# Altium schematic sheet DualRail_TPS6513x.SchDoc
size A4
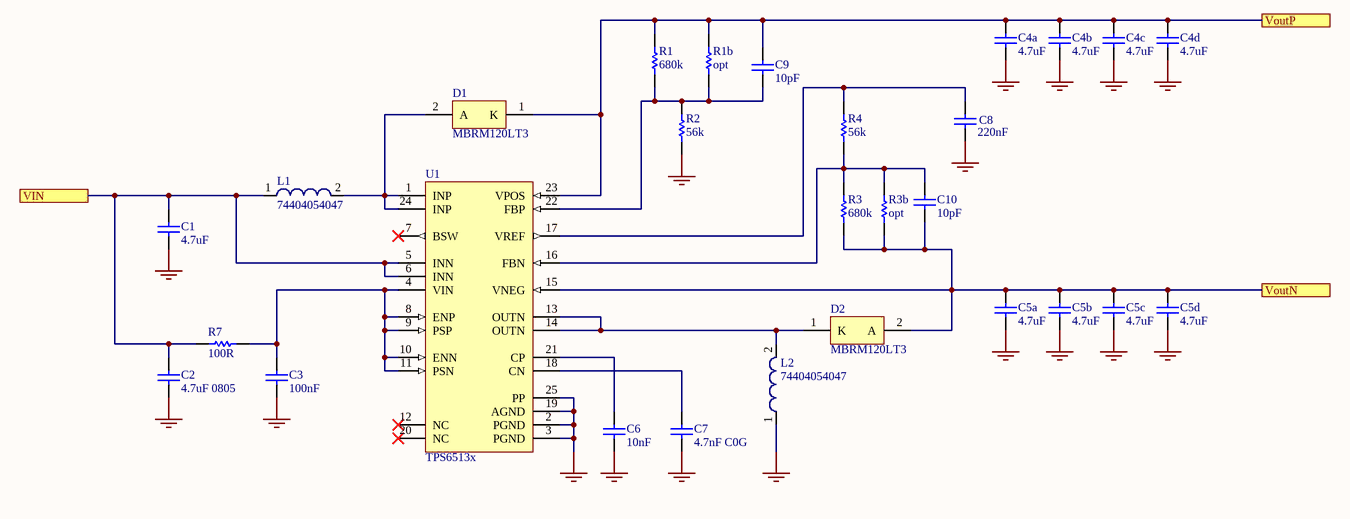
[diagram p0: DualRail_TPS6513x.SchDoc]

## Parts
C1  4.7uF  [CAPC1206(3216)190_L]
C2  4.7uF 0805  [CAPC0805(2012)155_N]
C3  100nF  [CAPC0603(1608)100_L]
C4a  4.7uF  [CAPC1206(3216)190_L]
C4b  4.7uF  [CAPC1206(3216)190_L]
C4c  4.7uF  [CAPC1206(3216)190_L]
C4d  4.7uF  [CAPC1206(3216)190_L]
C5a  4.7uF  [CAPC1206(3216)190_L]
C5b  4.7uF  [CAPC1206(3216)190_L]
C5c  4.7uF  [CAPC1206(3216)190_L]
C5d  4.7uF  [CAPC1206(3216)190_L]
C6  10nF  [CAPC0603(1608)100_L]
C7  4.7nF C0G  [CAPC0805(2012)75_L]
C8  220nF  [CAPC0603(1608)100_L]
C9  10pF  [CAPC0603(1608)100_L]
C10  10pF  [CAPC0603(1608)100_L]
D1  MBRM120LT3  [ONSC-POWERMITE-2-457-04_D_V]
D2  MBRM120LT3  [ONSC-POWERMITE-2-457-04_D_V]
L1  74404054047  [WE-LQS 5040]
L2  74404054047  [WE-LQS 5040]
R1  680k  [RESC0603(1608)_L]
R1b  opt  [RESC0603(1608)_L]
R2  56k  [RESC0603(1608)_L]
R3  680k  [RESC0603(1608)_L]
R3b  opt  [RESC0603(1608)_L]
R4  56k  [RESC0603(1608)_L]
R7  100R  [RESC0603(1608)_L]
U1  TPS6513x  [TI-RGE24-2450X2450TP_V]

## Ports
VIN, VoutN, VoutP

## Nets
GND: C1.1 C2.1 C3.1 C4a.1 C4b.1 C4c.1 C4d.1 C5a.1 C5b.1 C5c.1 C5d.1 C6.1 C7.1 C8.1 L2.1 R2.2 U1.2(PGND) U1.3(PGND) U1.19(AGND) U1.25(PP)
VIN: C1.2 C2.2 L1.1 R7.2 U1.5(INN) U1.6(INN) ; port VIN
VoutN: C5a.2 C5b.2 C5c.2 C5d.2 C10.2 D2.2(A) R3.2 R3b.2 U1.15(VNEG) ; port VoutN
VoutP: C4a.2 C4b.2 C4c.2 C4d.2 C9.2 D1.1(K) R1.1 R1b.1 U1.23(VPOS) ; port VoutP
NetC3_2: C3.2 R7.1 U1.4(VIN) U1.8(ENP) U1.9(PSP) U1.10(ENN) U1.11(PSN)
NetC6_2: C6.2 U1.21(CP)
NetC7_2: C7.2 U1.18(CN)
NetC8_2: C8.2 R4.1 U1.17(VREF)
NetC9_1: C9.1 R1.2 R1b.2 R2.1 U1.22(FBP)
NetC10_1: C10.1 R3.1 R3b.1 R4.2 U1.16(FBN)
NetD1_2: D1.2(A) L1.2 U1.1(INP) U1.24(INP)
NetD2_1: D2.1(K) L2.2 U1.13(OUTN) U1.14(OUTN)

Not connected (* = marked no-connect by the designer): U1 7(BSW)* 12(NC)* 20(NC)*

## Library data of the parts
C1 C4a C4b C4c C4d C5a C5b C5c C5d = CMP-1037-04919-1: CAP 4.7uF 25V ±20% 1206 (3216 Metric) Thickness 1.9mm SMD; Tolerance: Â±20%; Case-Metric: 3216; Case-EIA: 1206; Max Thickness: 1.9 mm; Value: 4.7uF; Technology: SMT; Rated Voltage: 25 V
C2 = CMP-1036-04882-1: CAP 4.7uF 10V ±10% 0805 (2012 Metric) Thickness 1.55mm SMD; Case-EIA: 0805; Tolerance: Â±10%; Case-Metric: 2012; Rated Voltage: 10 V; Max Thickness: 1.55 mm; Technology: SMT; Value: 4.7uF
C3 C6 = CMP-1035-02589-1: CAP 100nF 25V ±20% 0603 (1608 Metric) Thickness 1mm SMD; Case-EIA: 0603; Tolerance: Â±20%; Case-Metric: 1608; Value: 100nF; Max Thickness: 1 mm; Technology: SMT; Rated Voltage: 25 V
C7 = CMP-1036-03595-1: CAP 4.7nF 50V ±20% 0805 (2012 Metric) Thickness 0.75mm SMD; Case-EIA: 0805; Case-Metric: 2012; Tolerance: Â±20%; Technology: SMT; Value: 4.7nF; Rated Voltage: 50 V; Max Thickness: 0.75 mm
C8 = CMP-1035-02639-1: CAP 220nF 10V ±5% 0603 (1608 Metric) Thickness 1mm SMD; Case-EIA: 0603; Tolerance: Â±5%; Case-Metric: 1608; Value: 220nF; Max Thickness: 1 mm; Technology: SMT; Rated Voltage: 10 V
C9 C10 = CMP-1035-02639-1: Case-EIA: 0603; Value: 220nF; Tolerance: Â±5%; Case-Metric: 1608; Rated Voltage: 10 V; Max Thickness: 1 mm; Technology: SMT
D1 D2 = CMP-1055-00282-1: Schottky Power Rectifier, 2-Pin Powermite, Tape and Reel; Manufacturer: On Semiconductor; Note1: 0; IFSM Max (A): 50; Configuration: Single; Mounting Technology: Surface Mount; PackageReference: POWERMITE-2-457-04; PackageDescription: 2-Pin POWERMITE, Body 1.965 x 1.9 mm; PackageVersion: Rev. F, 05/2013; RoHS: FALSE; DatasheetVersion: Rev. 7; ComponentLink3URL: http://www.onsemi.com/pub_link/Collateral/457-04.PDF; ComponentLink2Description: Datasheet; ComponentLink3Description: Package Specification; ComponentLink1URL: http://www.onsemi.com/; ComponentLink1Description: Manufacturer URL; ComponentLink2URL: http://www.onsemi.cn/pub_link/Collateral/MBRM120L-D.PDF; PartNumber: MBRM120LT3; Packing: Tape and Reel
L1 L2 = CMP-1354-00047-1: WE-LQS SMD Power Inductor, L=4.7 µH; Manufacturer: Wuerth Elektronik; Inductance: 4.7 ÂµH; ComponentLink2Description: Datasheet; PackageReference: WE-LQS 5040; ComponentLink1URL: http://www.we-online.com; PartNumber: 74404054047; ComponentLink1Description: Manufacturer URL; ComponentLink2URL: http://katalog.we-online.de/pbs/datasheet/74404054047.pdf
R1 R1b R2 R3 R3b R4 = CMP-1012-00397-1: Value: 100.00 Ohm; Case-EIA: 0603; Tolerance: 1 %; Power: 0.1 W; Case-Metric: 1608; Technology: SMT
R7 = CMP-1012-00397-1: 100R 0.1W 1% 0603 (1608 Metric)  SMD; Value: 100.00 Ohm; Case-EIA: 0603; Case-Metric: 1608; Technology: SMT; Tolerance: 1 %; Power: 0.1 W
U1 = CMP-0388-00544-1: TPS65130 or TPS65131 Postive and Negative Output DC-DC Converter; PartNumber: TPS65130RGET; Manufacturer: Texas Instruments; SubFamily: LCD/OLED Display Bias Solutions; Rating: Catalog; Iq(Typ)(mA): 0.5; Topology: Boost, Inverting Buck/Boost; Vin(Min)(V): 2.7; Eco-Plan: Green (RoHS & no Sb/Br); Switching Frequency(Typ)(kHz): 1400; Vin(Max)(V): 5.5; Code_JEDEC: MO-220; ComponentLink1Description: Manufacturer URL; ComponentLink3Description: Package Specification; PackageReference: RGE24-2450X2450TP; ComponentLink3URL: http://www.ti.com/litv/pdf/mpqf124f; PackageVersion: 4204104/G; ComponentLink2URL: http://www.ti.com/general/docs/lit/getliterature.tsp?genericPartNumber=TPS65130&fileType=pdf; ComponentLink2Description: Datasheet; DatasheetVersion: SLVS493B; ComponentLink1URL: http://www.ti.com/; PackageDescription: 24-Pin Plastic Flat Pack, Body 4 x 4 mm, 0.5 mm Pitch; Mounting Technology: Surface Mount